# Altium schematic sheet Headlight_Right_Board.SchDoc: Right Headlights
size Letter; DocumentNumber: 5; Revision: 1.0; SheetNumber: 5; SheetTotal: 5; Website: www.uwmidsun.com; ProjectName: Lights Board
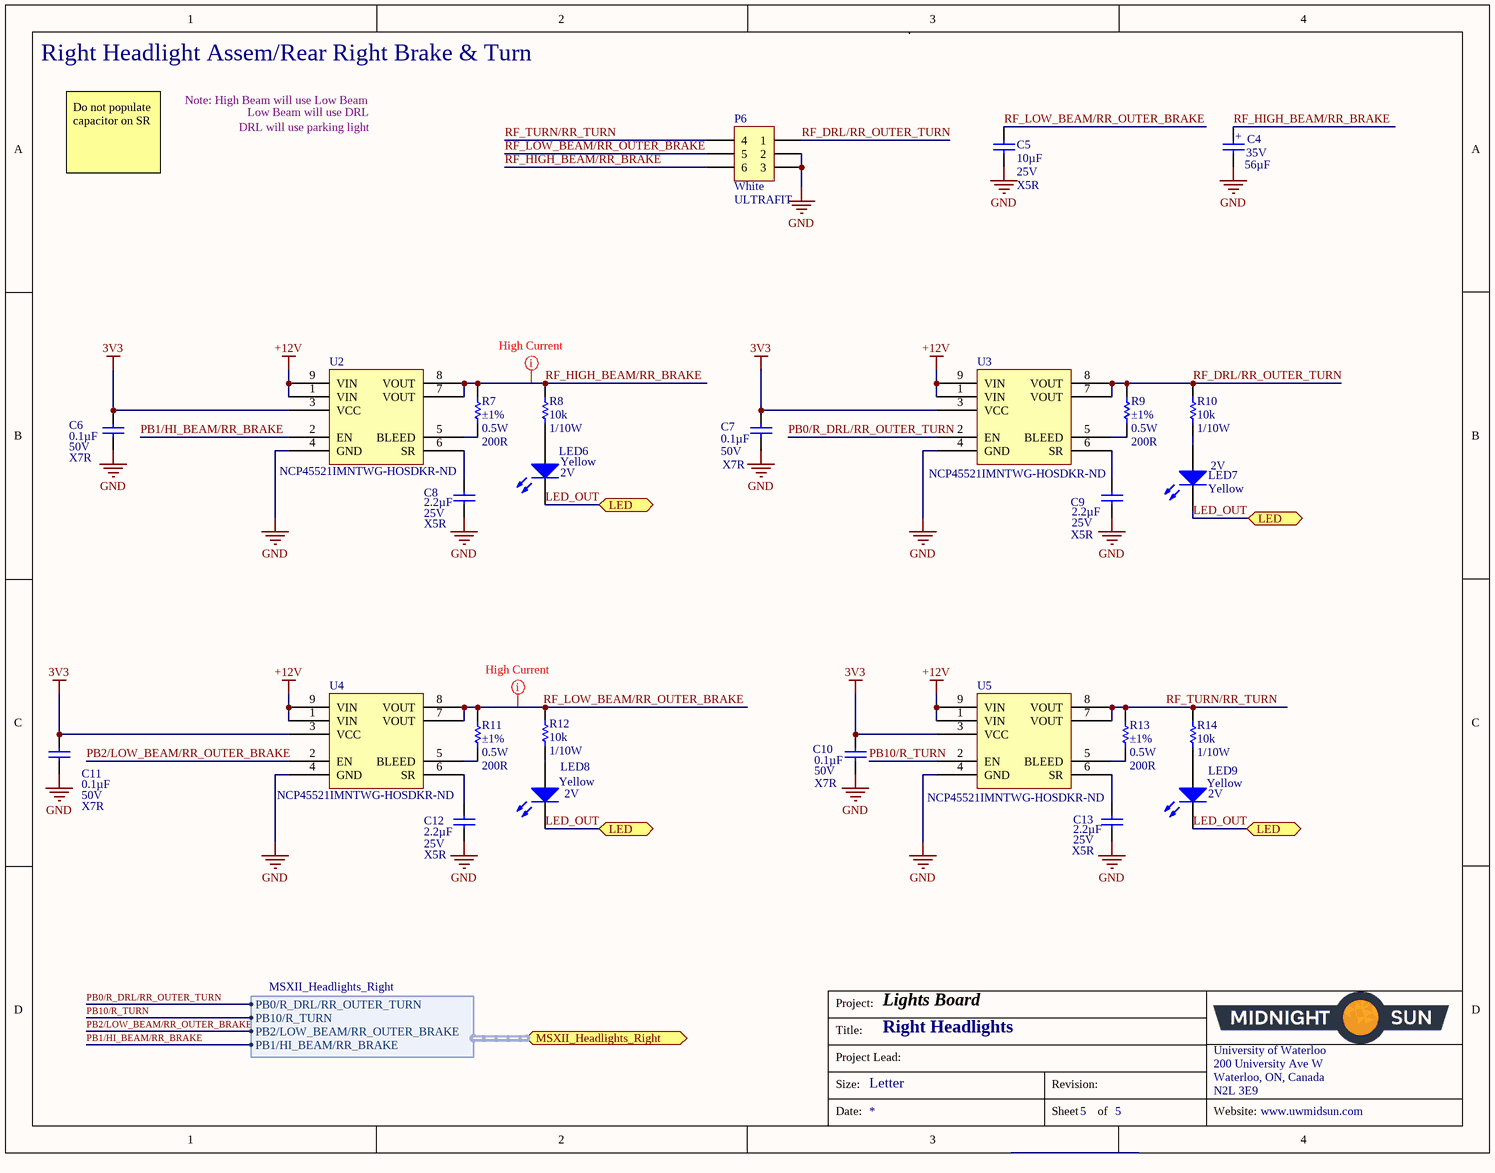
[diagram p0: Headlight_Right_Board.SchDoc]

## Parts
C4  Voltage: 35V  Capacitance: 56µF  [CAP ALUM 56UF 20% 35V RADIAL]  (hidden comment: CAP ALUM 56UF 20% 35V RADIAL)
C5  Capacitance: 10µF  Voltage: 25V  Temperature Coefficient: X5R  [CAP, 0603]  (hidden comment: CAP CER 10uF 25V 20% X5R 0603)
C6  Capacitance: 0.1µF  Voltage: 50V  Temperature Coefficient: X7R  [CAP, 0603]  (hidden comment: CAP CER 0.1UF 50V 10% X7R 0603)
C7  Capacitance: 0.1µF  Voltage: 50V  Temperature Coefficient: X7R  [CAP, 0603]  (hidden comment: CAP CER 0.1UF 50V 10% X7R 0603)
C8  Capacitance: 2.2µF  Voltage: 25V  Temperature Coefficient: X5R  [CAP, 0603]  (hidden comment: CAP CER 2.2UF 25V 10% X5R 0603)  (no BOM)
C9  Capacitance: 2.2µF  Voltage: 25V  Temperature Coefficient: X5R  [CAP, 0603]  (hidden comment: CAP CER 2.2UF 25V 10% X5R 0603)  (no BOM)
C10  Capacitance: 0.1µF  Voltage: 50V  Temperature Coefficient: X7R  [CAP, 0603]  (hidden comment: CAP CER 0.1UF 50V 10% X7R 0603)
C11  Capacitance: 0.1µF  Voltage: 50V  Temperature Coefficient: X7R  [CAP, 0603]  (hidden comment: CAP CER 0.1UF 50V 10% X7R 0603)
C12  Capacitance: 2.2µF  Voltage: 25V  Temperature Coefficient: X5R  [CAP, 0603]  (hidden comment: CAP CER 2.2UF 25V 10% X5R 0603)  (no BOM)
C13  Capacitance: 2.2µF  Voltage: 25V  Temperature Coefficient: X5R  [CAP, 0603]  (hidden comment: CAP CER 2.2UF 25V 10% X5R 0603)  (no BOM)
LED6  Color: Yellow  Voltage - Forward (Vf) (Typ): 2V  [LED_0603]  (hidden comment: LED YELLOW CLEAR 2.1V 0603)
LED7  Color: Yellow  Voltage - Forward (Vf) (Typ): 2V  [LED_0603]  (hidden comment: LED YELLOW CLEAR 2.1V 0603)
LED8  Color: Yellow  Voltage - Forward (Vf) (Typ): 2V  [LED_0603]  (hidden comment: LED YELLOW CLEAR 2.1V 0603)
LED9  Color: Yellow  Voltage - Forward (Vf) (Typ): 2V  [LED_0603]  (hidden comment: LED YELLOW CLEAR 2.1V 0603)
P6  Insulation Color: White  Series: ULTRAFIT  [CONN, 6POS ULTRA-FIT - NATURAL COLOR]  (hidden comment: CONN 6POS ULTRA-FIT NATURAL COLOR 0.138")
R7  value 200R  Tolerance: ±1%  Power (Watts): 0.5W  [RES 0805]  (hidden comment: RES SMD 200 OHM 1% 1/2W 0805)
R8  Resistance: 10k  Power: 1/10W  [RES, 0603]  (hidden comment: RES 10K OHM 1% 1/10W 0603)
R9  value 200R  Tolerance: ±1%  Power (Watts): 0.5W  [RES 0805]  (hidden comment: RES SMD 200 OHM 1% 1/2W 0805)
R10  Resistance: 10k  Power: 1/10W  [RES, 0603]  (hidden comment: RES 10K OHM 1% 1/10W 0603)
R11  value 200R  Tolerance: ±1%  Power (Watts): 0.5W  [RES 0805]  (hidden comment: RES SMD 200 OHM 1% 1/2W 0805)
R12  Resistance: 10k  Power: 1/10W  [RES, 0603]  (hidden comment: RES 10K OHM 1% 1/10W 0603)
R13  value 200R  Tolerance: ±1%  Power (Watts): 0.5W  [RES 0805]  (hidden comment: RES SMD 200 OHM 1% 1/2W 0805)
R14  Resistance: 10k  Power: 1/10W  [RES, 0603]  (hidden comment: RES 10K OHM 1% 1/10W 0603)
U2  Supplier Part Number 2: NCP45521IMNTWG-HOSDKR-ND  [IC LOAD SWITCH ACT-HI 10.5A 8DFN]  (hidden comment: IC LOAD SWITCH ACT-HI 10.5A 8DFN)
U3  Supplier Part Number 2: NCP45521IMNTWG-HOSDKR-ND  [IC LOAD SWITCH ACT-HI 10.5A 8DFN]  (hidden comment: IC LOAD SWITCH ACT-HI 10.5A 8DFN)
U4  Supplier Part Number 2: NCP45521IMNTWG-HOSDKR-ND  [IC LOAD SWITCH ACT-HI 10.5A 8DFN]  (hidden comment: IC LOAD SWITCH ACT-HI 10.5A 8DFN)
U5  Supplier Part Number 2: NCP45521IMNTWG-HOSDKR-ND  [IC LOAD SWITCH ACT-HI 10.5A 8DFN]  (hidden comment: IC LOAD SWITCH ACT-HI 10.5A 8DFN)

## Ports
LED, MSXII_Headlights_Right (harness MSXII_Headlights_Right)

## Harnesses
MSXII_Headlights_Right: PB0/R_DRL/RR_OUTER_TURN, PB10/R_TURN, PB2/LOW_BEAM/RR_OUTER_BRAKE, PB1/HI_BEAM/RR_BRAKE

## Nets
3V3: C6.1 C7.1 C10.1 C11.1 U2.3(VCC) U3.3(VCC) U4.3(VCC) U5.3(VCC)
+12V: U2.1(VIN) U2.9(VIN) U3.1(VIN) U3.9(VIN) U4.1(VIN) U4.9(VIN) U5.1(VIN) U5.9(VIN)
GND: C4.2 C5.1 C6.2 C7.2 C8.2 C9.2 C10.2 C11.2 C12.2 C13.2 P6.2 P6.3 U2.4(GND) U3.4(GND) U4.4(GND) U5.4(GND)
LED_OUT: LED6.2(K) LED7.2(K) LED8.2(K) LED9.2(K) ; port LED
PB0/R_DRL/RR_OUTER_TURN: U3.2(EN) ; port MSXII_Headlights_Right.PB0/R_DRL/RR_OUTER_TURN
PB1/HI_BEAM/RR_BRAKE: U2.2(EN) ; port MSXII_Headlights_Right.PB1/HI_BEAM/RR_BRAKE
PB2/LOW_BEAM/RR_OUTER_BRAKE: U4.2(EN) ; port MSXII_Headlights_Right.PB2/LOW_BEAM/RR_OUTER_BRAKE
PB10/R_TURN: U5.2(EN) ; port MSXII_Headlights_Right.PB10/R_TURN
RF_DRL/RR_OUTER_TURN: P6.1 R9.1 R10.1 U3.7(VOUT) U3.8(VOUT)
RF_HIGH_BEAM/RR_BRAKE: C4.1 P6.6 R7.2 R8.1 U2.7(VOUT) U2.8(VOUT)
RF_LOW_BEAM/RR_OUTER_BRAKE: C5.2 P6.5 R11.1 R12.1 U4.7(VOUT) U4.8(VOUT)
RF_TURN/RR_TURN: P6.4 R13.1 R14.1 U5.7(VOUT) U5.8(VOUT)
NetC8_1: C8.1 U2.6(SR)
NetC9_1: C9.1 U3.6(SR)
NetC12_1: C12.1 U4.6(SR)
NetC13_1: C13.1 U5.6(SR)
NetLED6_1: LED6.1(A) R8.2
NetLED7_1: LED7.1(A) R10.2
NetLED8_1: LED8.1(A) R12.2
NetLED9_1: LED9.1(A) R14.2
NetR7_1: R7.1 U2.5(BLEED)
NetR9_2: R9.2 U3.5(BLEED)
NetR11_2: R11.2 U4.5(BLEED)
NetR13_2: R13.2 U5.5(BLEED)

## Layout directives
rule Power Plane Connect Style [Style - Direct Connect]: RF_HIGH_BEAM/RR_BRAKE, RF_LOW_BEAM/RR_OUTER_BRAKE

## Notes on the sheet
- Right Headlight Assem/Rear Right Brake & Turn
- Do not populate capacitor on SR
- Note: High Beam will use Low Beam
- DRL will use parking light
- Low Beam will use DRL
- Project:
- Title:
- Size:
- Project Lead:
- Letter
- Revision:
- University of Waterloo
- 200 University Ave W
- Waterloo, ON, Canada
- N2L 3E9
- Date:
- Sheet
- of
- Website:
- (in symbol CAP ALUM 56UF 20% 35V RADIAL) +

## Library data of the parts
C4 = CAP ALUM 56UF 20% 35V RADIAL: 56µF 35V Aluminum Electrolytic Capacitors Radial, Can 1000 Hrs @ 105°C; Manufacturer: Panasonic Electronic Components; Manufacturer Part Number: EEU-FC1V560H; Polarization: Polar; Supplier 1: Digi-Key; RoHS: RoHS Compliant; Category: Capacitors; Stock 1: 21680; Pricing 1: 1=0.49, 10=0.347, 100=0.2082, 500=0.15622, 1000=0.13193 (CAD); Packaging: Cut Tape (CT); Part Status: Active; ESR (Equivalent Series Resistance): -; Lifetime @ Temp.: 1000 Hrs @ 105°C; Operating Temperature: -55°C ~ 105°C; Ratings: AEC-Q200; Applications: Automotive; Lead Spacing: 0.098" (2.50mm); Size / Dimension: 0.248" Dia (6.30mm); Height - Seated (Max): 0.480" (12.20mm); Surface Mount Land Size: -; Mounting Type: Through Hole; Package / Case: Radial, Can; ComponentLink1URL: http://industrial.panasonic.com/www-cgi/jvcr13pz.cgi?E+PZ+3+ABA0022+EEUFC1V560H+7+WW; ComponentLink1Description: http://industrial.panasonic.com/www-cgi/jvcr13pz.cgi?E+PZ+3+ABA0022+EEUFC1V560H+7+WW; Supplier Part Number 1: P19684CT-ND
C5 = CAP CER 10uF 25V 20% X5R 0603: 10µF ±20% 25V Ceramic Capacitor X5R 0603 (1608 Metric); Manufacturer 1: Murata Electronics North America; Manufacturer Part Number 1: GRM188R61E106MA73D; Supplier 1: Digi-Key; Supplier Part Number 1: 490-7202-1-ND; Packaging: Cut Tape (CT); Part Status: Active; Operating Temperature: -55°C ~ 85°C; Ratings: -; Mounting Type: Surface Mount, MLCC; Package / Case: 0603 (1608 Metric); Size / Dimension: 0.063" L x 0.031" W (1.60mm x 0.80mm); Height - Seated (Max): -; Thickness (Max): 0.031" (0.80mm); Lead Spacing: -; Lead Style: -; ComponentLink1URL: http://www.murata.com/~/media/webrenewal/support/library/catalog/products/capacitor/mlcc/c02e.ashx; ComponentLink1Description: http://www.murata.com/~/media/webrenewal/support/library/catalog/products/capacitor/mlcc/c02e.ashx; Tolerance: ±20%
C6 C7 C10 C11 = CAP CER 0.1UF 50V 10% X7R 0603: 0.10µF ±10% 50V Ceramic Capacitor X7R 0603 (1608 Metric); Manufacturer 1: AVX Corporation; Manufacturer Part Number 1: 06035C104KAT2A; Supplier 1: Digi-Key; Supplier Part Number 1: 478-5052-1-ND; Packaging: Cut Tape (CT); Part Status: Active; Operating Temperature: -55°C ~ 125°C; Ratings: -; Mounting Type: Surface Mount, MLCC; Package / Case: 0603 (1608 Metric); Size / Dimension: 0.063" L x 0.032" W (1.60mm x 0.81mm); Height - Seated (Max): -; Thickness (Max): 0.035" (0.90mm); Lead Spacing: -; Lead Style: -; ComponentLink1URL: http://datasheets.avx.com/X7RDielectric.pdf; ComponentLink1Description: http://datasheets.avx.com/X7RDielectric.pdf; Tolerance: ±10%
C8 C9 C12 C13 = CAP CER 2.2UF 25V 10% X5R 0603: 2.2µF ±10% 25V Ceramic Capacitor X5R 0603 (1608 Metric); Manufacturer 1: Murata Electronics North America; Manufacturer Part Number 1: GRM188R61E225KA12D; Supplier 1: Digi-Key; Supplier Part Number 1: 490-10731-1-ND; Packaging: Cut Tape (CT); Part Status: Active; Operating Temperature: -55°C ~ 85°C; Ratings: -; Mounting Type: Surface Mount, MLCC; Package / Case: 0603 (1608 Metric); Size / Dimension: 0.063" L x 0.031" W (1.60mm x 0.80mm); Height - Seated (Max): -; Thickness (Max): 0.035" (0.90mm); Lead Spacing: -; Lead Style: -; ComponentLink1URL: http://www.murata.com/~/media/webrenewal/support/library/catalog/products/capacitor/mlcc/c02e.ashx; ComponentLink1Description: http://www.murata.com/~/media/webrenewal/support/library/catalog/products/capacitor/mlcc/c02e.ashx; Tolerance: ±10%
LED6-LED9 = LED YELLOW CLEAR 2.1V 0603: Yellow 590nm LED Indication - Discrete 2V 0603 (1608 Metric); Manufacturer: Wurth Electronics Inc.; Manufacturer Part Number: 150060YS75000; Lens Color: Colorless; Millicandela Rating: 120mcd; Lens Style/Size: Rectangle with Flat Top, 1.10mm x 0.70mm; Current - Test: 20mA; Viewing Angle: 140°; Wavelength - Peak: 595nm; Supplier 1: Digi-Key; RoHS: RoHS Compliant; Category: Optoelectronics; Stock 1: 10523; Pricing 1: 1=0.21, 100=0.1617, 500=0.13964 (CAD); Packaging: Cut Tape (CT); Part Status: Active; Lens Transparency: Clear; Mounting Type: Surface Mount; Wavelength - Dominant: 590nm; Features: -; Package / Case: 0603 (1608 Metric); Supplier Device Package: 0603; Size / Dimension: 1.60mm L x 0.80mm W; Height (Max): 0.80mm; ComponentLink1URL: http://katalog.we-online.de/led/datasheet/150060YS75000.pdf; ComponentLink1Description: http://katalog.we-online.de/led/datasheet/150060YS75000.pdf; Supplier Part Number 1: 732-4981-1-ND
P6 = CONN 6POS ULTRA-FIT NATURAL COLOR 0.138": 6 Positions Header Connector 0.138" (3.50mm) Through Hole Tin; Manufacturer 1: Molex, LLC; Manufacturer Part Number 1: 1722992106; Description 1: ULTRAFIT VERT TIN PLATED NAT; Style: Board to Cable/Wire; Shrouding: Shrouded - 4 Wall; Number of Positions: 6; Number of Positions Loaded: All; Row Spacing - Mating: 0.181" (4.60mm); Contact Length - Post: 0.126" (3.20mm); Material Flammability Rating: UL94 V-0; Voltage Rating: 400V; Mated Stacking Heights: 26.99mm; Supplier 1: Digi-Key; Supplier Part Number 1: WM11799-ND; RoHS: RoHS Compliant; Category: Connectors, Interconnects; Stock 1: 315; Pricing 1: 1=1.85, 10=1.617, 50=1.4586, 100=1.395, 250=1.26816, 500=1.14134, 1000=1.01453, 2500=0.91942, 5000=0.88771 (CAD); Packaging: Tray; Part Status: Active; Connector Type: Header; Contact Type: Male Pin; Pitch - Mating: 0.138" (3.50mm); Number of Rows: 2; Mounting Type: Through Hole; Termination: Solder; Fastening Type: Latch Holder; Contact Length - Mating: -; Overall Contact Length: -; Insulation Height: 0.465" (11.80mm); Contact Shape: Square; Contact Finish - Mating: Tin; Contact Finish Thickness - Mating: 60µin (1.52µm); Contact Finish - Post: Tin; Contact Material: Copper Alloy; Insulation Material: Liquid Crystal Polymer (LCP); Features: Board Guide, Solder Retention; Operating Temperature: -40°C ~ 105°C; Ingress Protection: -; Current Rating: -; Contact Finish Thickness - Post: 60µin (1.52µm); Applications: Automotive, General Purpose, Industrial, Lighting, Medical, Military, Telecommunications; ComponentLink1URL: http://www.molex.com/pdm_docs/sd/1722992106_sd.pdf; ComponentLink1Description: http://www.molex.com/pdm_docs/sd/1722992106_sd.pdf
R7 R9 R11 R13 = RES SMD 200 OHM 1% 1/2W 0805: 200 Ohms ±1% 0.5W, 1/2W Chip Resistor 0805 (2012 Metric) Automotive AEC-Q200, Pulse Withstanding Thick Film; Manufacturer: Panasonic Electronic Components; Manufacturer Part Number: ERJ-P06F2000V; Temperature Coefficient: ±100ppm/°C; Supplier 1: Digi-Key; RoHS: RoHS Compliant; Category: Resistors; Stock 1: 46246; Pricing 1: 1=0.27, 10=0.226, 100=0.0884, 1000=0.03699, 2500=0.0339 (CAD); Packaging: Cut Tape (CT); Part Status: Active; Composition: Thick Film; Features: Automotive AEC-Q200, Pulse Withstanding; Operating Temperature: -55°C ~ 155°C; Package / Case: 0805 (2012 Metric); Supplier Device Package: 0805; Size / Dimension: 0.079" L x 0.049" W (2.00mm x 1.25mm); Height - Seated (Max): 0.028" (0.70mm); Failure Rate: -; ComponentLink1URL: https://industrial.panasonic.com/cdbs/www-data/pdf/RDO0000/AOA0000C331.pdf; ComponentLink1Description: https://industrial.panasonic.com/cdbs/www-data/pdf/RDO0000/AOA0000C331.pdf
R8 R10 R12 R14 = RES 10K OHM 1% 1/10W 0603: RES SMD 10K OHM 1% 1/10W 0603; Manufacturer 1: Yageo; Manufacturer Part Number 1: RC0603FR-0710KL; Temperature Coefficient: ±100ppm/°C; Supplier 1: Digi-Key; Supplier Part Number 1: 311-10.0KHRCT-ND; Packaging: Cut Tape (CT); Part Status: Active; Composition: Thick Film; Operating Temperature: -55°C ~ 155°C; Package / Case: 0603 (1608 Metric); Supplier Device Package: 0603; Size / Dimension: 0.063" L x 0.031" W (1.60mm x 0.80mm); Height - Seated (Max): 0.022" (0.55mm); Failure Rate: -; ComponentLink1URL: http://www.yageo.com/documents/recent/PYu-RC_Group_51_RoHS_L_7.pdf; ComponentLink1Description: http://www.yageo.com/documents/recent/PYu-RC_Group_51_RoHS_L_7.pdf; Tolerance: ±1%
U2-U5 = IC LOAD SWITCH ACT-HI 10.5A 8DFN: NCP45521IMNTWG-H; Manufacturer: ON Semiconductor; Switch Type: General Purpose; Number of Outputs: 1; Ratio - Input:Output: 1:1; Output Configuration: High Side; Output Type: N-Channel; Interface: On/Off; Voltage - Load: 0.5 V ~ 13.5 V; Voltage - Supply (Vcc/Vdd): 3 V ~ 5.5 V; Rds On (Typ): 12.8 mOhm; Input Type: Non-Inverting; Fault Protection: Over Temperature, UVLO; Manufacturer Part Number: NCP45521IMNTWG-H; RoHS: RoHS Compliant; Category: Integrated Circuits (ICs); Packaging: Digi-Reel®; Part Status: Active; Current - Output (Max): 10.5A; Features: Slew Rate Controlled; Operating Temperature: -40°C ~ 85°C (TA); Package / Case: 8-VFDFN Exposed Pad; Supplier Device Package: 8-DFN (2x2); ComponentLink1URL: http://www.onsemi.com/pub/Collateral/NCP45520-D.PDF; ComponentLink1Description: http://www.onsemi.com/pub/Collateral/NCP45520-D.PDF; Supplier 1: Digi-Key; Stock 1: 2377; Pricing 1: 1=1.57, 10=1.405, 100=1.0957, 500=0.90518, 1000=0.71462 (CAD); Supplier 2: Digi-Key; Stock 2: 2211; Pricing 2: 1=1.53, 10=1.372, 100=1.0702, 500=0.88408, 1000=0.69797 (CAD)